# Altium schematic sheet prim_analog_in.SchDoc: foxBMS BMS-Slave 12-Cell
size A3; DocumentNumber: 9; SheetNumber: 9; SheetTotal: 19; AUTHOR: Fraunhofer IISB foxBMS Team; SheetDescription: Primary Analog Inputs
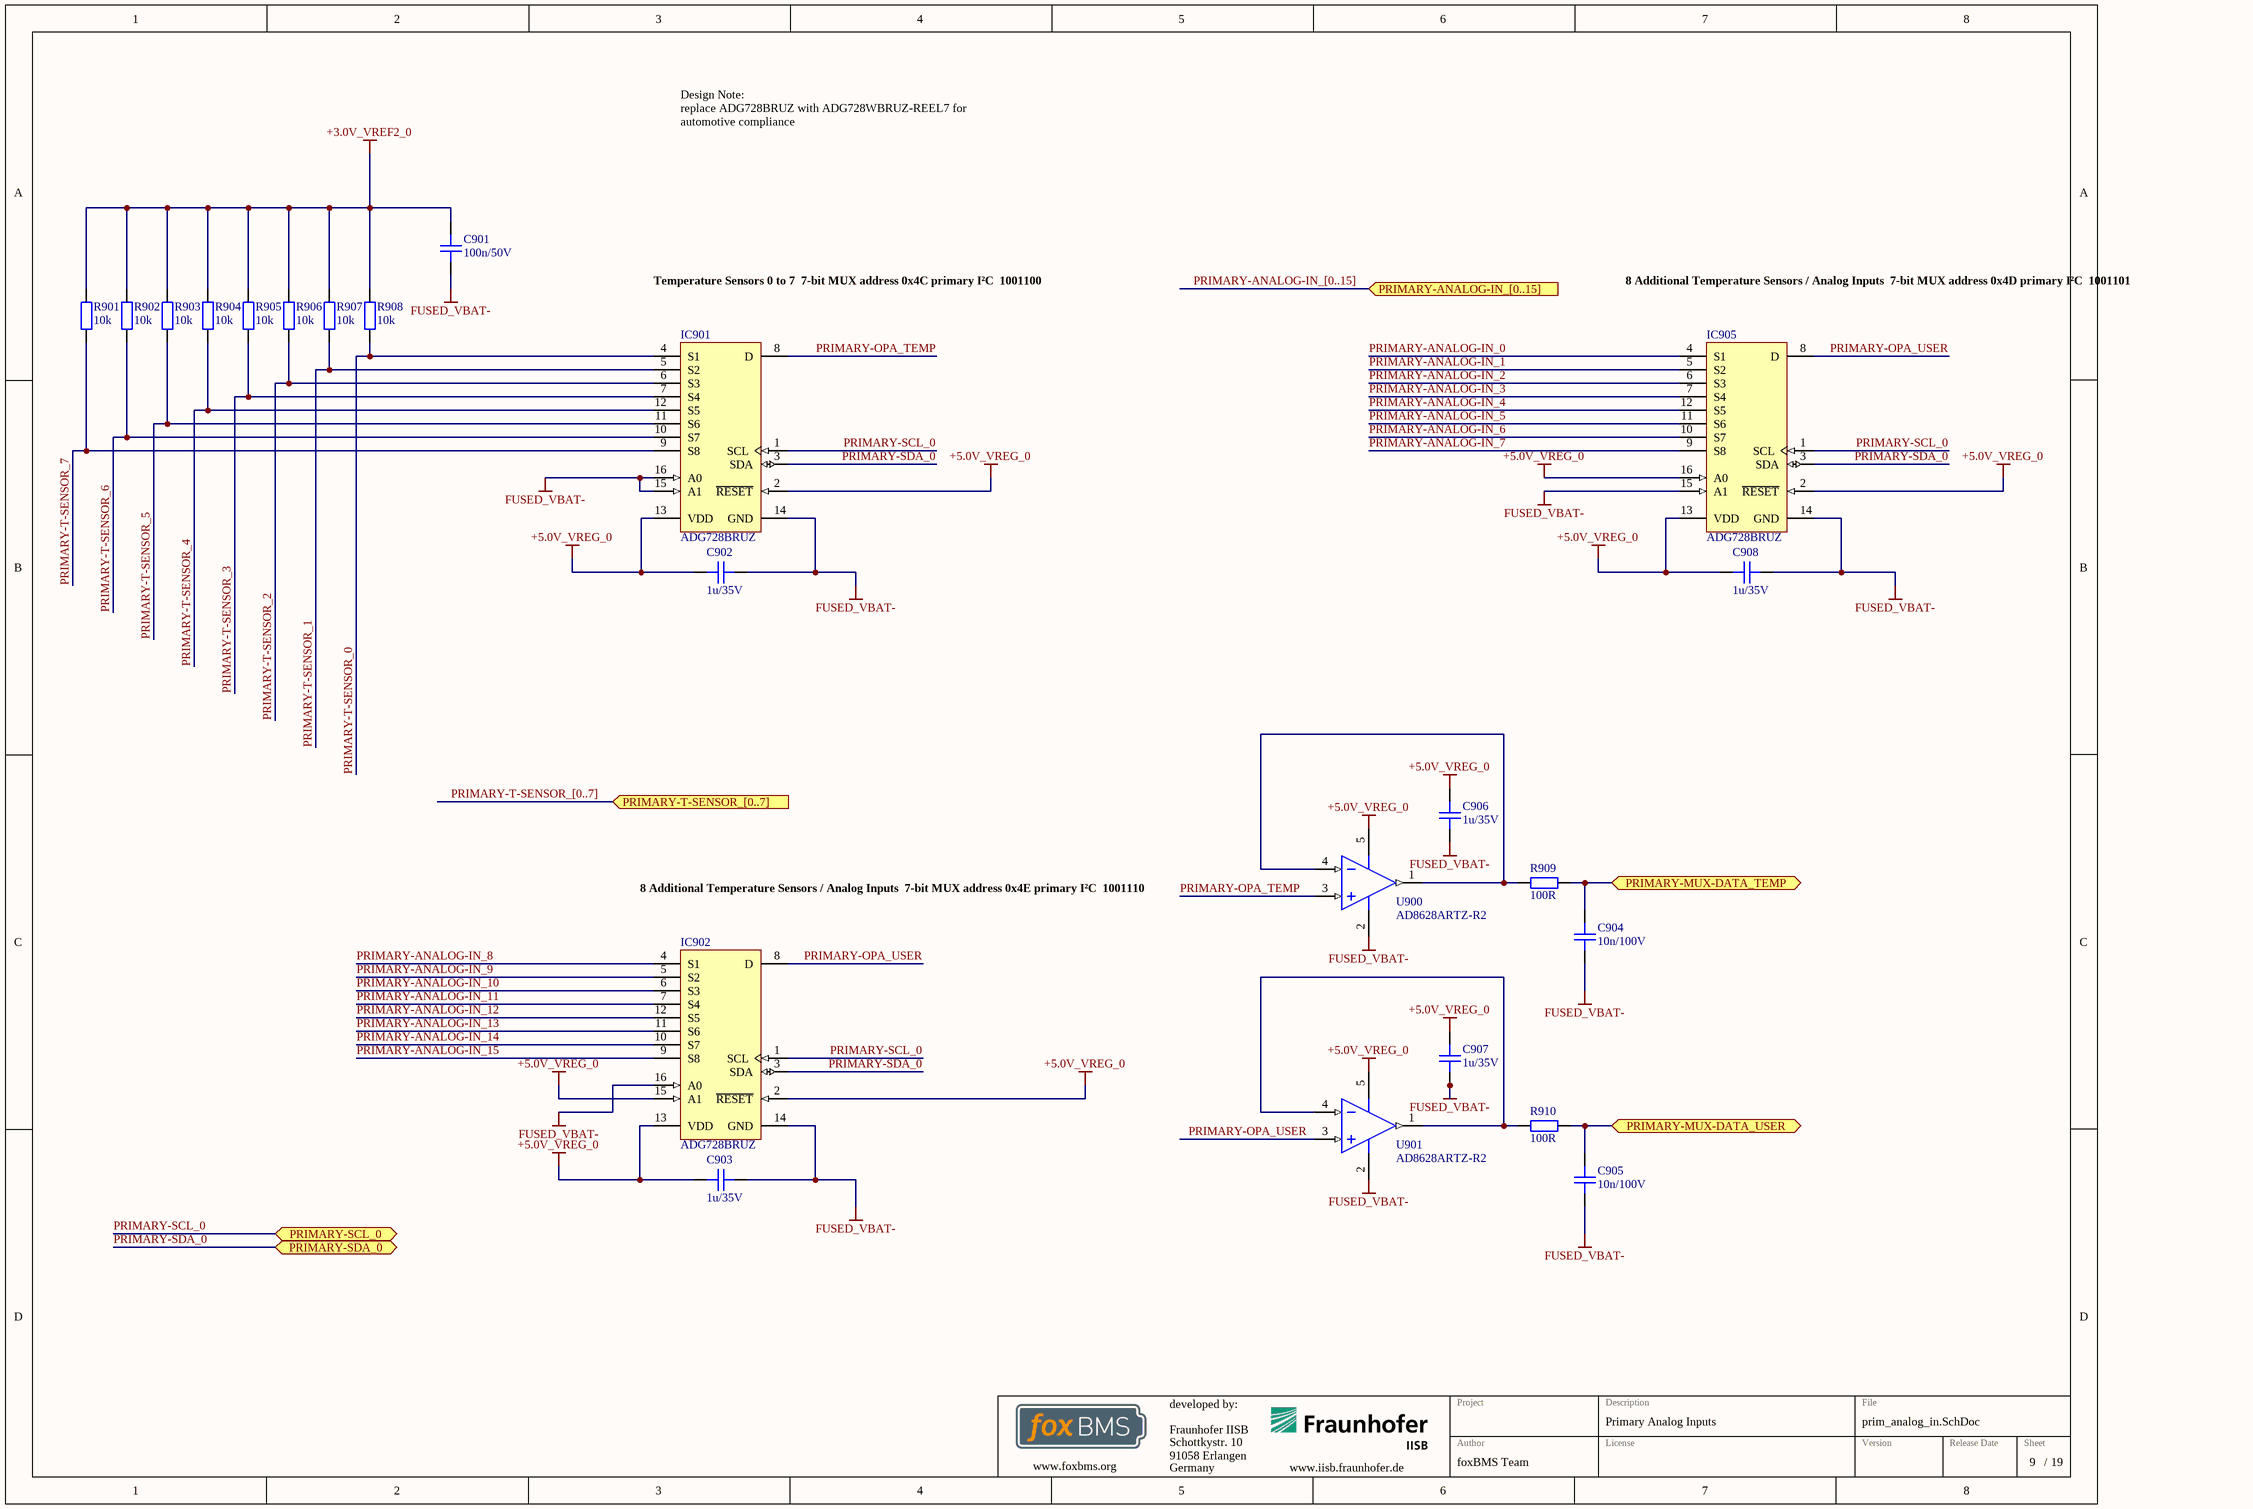
[diagram p0: prim_analog_in.SchDoc]

## Parts
C901  100n/50V  [CAPC1608X08N]
C902  1u/35V  [CAPC1608X08N]
C903  1u/35V  [CAPC1608X08N]
C904  10n/100V  [CAPC1608X08N]
C905  10n/100V  [CAPC1608X08N]
C906  1u/35V  [CAPC1608X08N]
C907  1u/35V  [CAPC1608X08N]
C908  1u/35V  [CAPC1608X08N]
IC901  ADG728BRUZ  [ADI-RU-16_M]
IC902  ADG728BRUZ  [ADI-RU-16_M]
IC905  ADG728BRUZ  [ADI-RU-16_M]
R901  10k  [RESC1608X05N]
R902  10k  [RESC1608X05N]
R903  10k  [RESC1608X05N]
R904  10k  [RESC1608X05N]
R905  10k  [RESC1608X05N]
R906  10k  [RESC1608X05N]
R907  10k  [RESC1608X05N]
R908  10k  [RESC1608X05N]
R909  100R  [RESC1608X05N]
R910  100R  [RESC1608X05N]
U900  AD8628ARTZ-R2  [ADI-RJ-5_M]
U901  AD8628ARTZ-R2  [ADI-RJ-5_M]

## Ports
PRIMARY-ANALOG-IN_[0..15] (in), PRIMARY-MUX-DATA_TEMP (bidir), PRIMARY-MUX-DATA_USER (bidir), PRIMARY-SCL_0 (bidir), PRIMARY-SDA_0 (bidir), PRIMARY-T-SENSOR_[0..7] (in)

## Nets
+3.0V_VREF2_0: C901.2 R901.2 R902.2 R903.2 R904.2 R905.2 R906.2 R907.2 R908.2
+5.0V_VREG_0: C902.2 C903.2 C906.2 C907.2 C908.2 IC901.2(~{RESET}) IC901.13(VDD) IC902.2(~{RESET}) IC902.13(VDD) IC902.15(A1) IC905.2(~{RESET}) IC905.13(VDD) IC905.16(A0) U900.5(+V) U901.5(+V)
FUSED_VBAT-: C901.1 C902.1 C903.1 C904.1 C905.1 C906.1 C907.1 C908.1 IC901.14(GND) IC901.15(A1) IC901.16(A0) IC902.14(GND) IC902.16(A0) IC905.14(GND) IC905.15(A1) U900.2(-V) U901.2(-V)
PRIMARY-ANALOG-IN_0: IC905.4(S1)
PRIMARY-ANALOG-IN_1: IC905.5(S2)
PRIMARY-ANALOG-IN_2: IC905.6(S3)
PRIMARY-ANALOG-IN_3: IC905.7(S4)
PRIMARY-ANALOG-IN_4: IC905.12(S5)
PRIMARY-ANALOG-IN_5: IC905.11(S6)
PRIMARY-ANALOG-IN_6: IC905.10(S7)
PRIMARY-ANALOG-IN_7: IC905.9(S8)
PRIMARY-ANALOG-IN_8: IC902.4(S1)
PRIMARY-ANALOG-IN_9: IC902.5(S2)
PRIMARY-ANALOG-IN_10: IC902.6(S3)
PRIMARY-ANALOG-IN_11: IC902.7(S4)
PRIMARY-ANALOG-IN_12: IC902.12(S5)
PRIMARY-ANALOG-IN_13: IC902.11(S6)
PRIMARY-ANALOG-IN_14: IC902.10(S7)
PRIMARY-ANALOG-IN_15: IC902.9(S8)
PRIMARY-MUX-DATA_TEMP: C904.2 R909.2 ; port PRIMARY-MUX-DATA_TEMP
PRIMARY-MUX-DATA_USER: C905.2 R910.2 ; port PRIMARY-MUX-DATA_USER
PRIMARY-OPA_TEMP: IC901.8(D) U900.3(+IN)
PRIMARY-OPA_USER: IC902.8(D) IC905.8(D) U901.3(+IN)
PRIMARY-SCL_0: IC901.1(SCL) IC902.1(SCL) IC905.1(SCL) ; port PRIMARY-SCL_0
PRIMARY-SDA_0: IC901.3(SDA) IC902.3(SDA) IC905.3(SDA) ; port PRIMARY-SDA_0
PRIMARY-T-SENSOR_0: IC901.4(S1) R908.1
PRIMARY-T-SENSOR_1: IC901.5(S2) R907.1
PRIMARY-T-SENSOR_2: IC901.6(S3) R906.1
PRIMARY-T-SENSOR_3: IC901.7(S4) R905.1
PRIMARY-T-SENSOR_4: IC901.12(S5) R904.1
PRIMARY-T-SENSOR_5: IC901.11(S6) R903.1
PRIMARY-T-SENSOR_6: IC901.10(S7) R902.1
PRIMARY-T-SENSOR_7: IC901.9(S8) R901.1
NetR909_1: R909.1 U900.1(OUT) U900.4(-IN)
NetR910_1: R910.1 U901.1(OUT) U901.4(-IN)

## Buses and harness runs
bus PRIMARY-ANALOG-IN_[0..15] = port PRIMARY-ANALOG-IN_[0..15]
bus PRIMARY-T-SENSOR_[0..7] = port PRIMARY-T-SENSOR_[0..7]

## Notes on the sheet
- Design Note:
  replace ADG728BRUZ with ADG728WBRUZ-REEL7 for automotive compliance
- Temperature Sensors 0 to 7
  7-bit MUX address 0x4C primary I²C
  1001100
- 8 Additional Temperature Sensors / Analog Inputs
  7-bit MUX address 0x4D primary I²C
  1001101
- 8 Additional Temperature Sensors / Analog Inputs
  7-bit MUX address 0x4E primary I²C
  1001110
- Fraunhofer IISB
- Schottkystr. 10
- developed by:
- 91058 Erlangen
- Germany
- Author
- Project
- License
- Description
- File
- Version
- Release Date
- Sheet
- www.foxbms.org
- www.iisb.fraunhofer.de
- foxBMS Team
- /

## Library data of the parts
C901 = gen_C_ceramic_100n_50V_X7R_0603: MLCC; Capacitance: 100n; Rated Voltage: 50V; Dielectric: X7R; Case EIA: 0603; Case Metric: 1608; PnP Package: C_0603_10; PnP Value: 100n/50V/X7R; PnP equipped: x; Automotive Qualified: False; Part Number: gen_C_ceramic_100n_50V_X7R_0603; Supplier 1: Farnell; Supplier Part Number 1: 2525267; Supplier 2: Digikey; Supplier Part Number 2: 490-6049-1-ND
C902 C903 C906-C908 = gen_C_ceramic_1u_35V_X7R_0603: MLCC; Capacitance: 1u; Rated Voltage: 35V; Dielectric: X7R; Case EIA: 0603; Case Metric: 1608; PnP Package: C_0603_10; PnP Value: 1uF/35V/X7R; PnP equipped: x; Automotive Qualified: False; Part Number: gen_C_ceramic_1u_35V_X7R_0603; Supplier 1: Farnell; Supplier Part Number 1: 1907508
C904 C905 = gen_C_ceramic_10n_100V_X7R_0603: MLCC; Capacitance: 10n; Rated Voltage: 100V; Dielectric: X7R; Case EIA: 0603; Case Metric: 1608; Automotive Qualified: False; Part Number: gen_C_ceramic_10n_100V_X7R_0603; Supplier 1: Farnell; Supplier Part Number 1: 1865545
IC901 IC902 IC905 = CMP-0798-00197-1: CMOS, Low Voltage, 2-Wire Serially Controlled, Matrix Switch, -40 to 85 degC, 16-pin SOP (RU-16), Tube; Manufacturer: Analog Devices; Ron (ohms): 2.5; Supply V Guar Performance: Single_(+3V), Single_(+5V); Max Analog Signal Range: 0 to Vdd; Bandwidth (Hz): 65M; ComponentLink3Description: Package Specification; Packing: Tube; PartNumber: ADG728BRUZ; ComponentLink1URL: http://www.analog.com/en/index.html; Mounting Technology: Surface Mount; DatasheetVersion: Rev. C; ComponentLink1Description: Manufacturer URL; ComponentLink3URL: http:/www.analog.com/static/imported-files/packages/36244347913743854010197452789RU16.pdf; ComponentLink2URL: http://www.analog.com/static/imported-files/data_sheets/ADG728_729.pdf; PackageVersion: Nov-02; PackageDescription: 16-Pin Thin Shrink Small Outline Package, Body 5 x 4.4 mm, Pitch 0.65 mm; Code_JEDEC: MO-153AB; PackageReference: RU-16; ComponentLink2Description: Datasheet
R901-R908 = gen_R_10k_0603: SMD Resistor 10k 0603; Tolerance: 1%; Power: 0.1W; Case EIA: 0603; Case Metric: 1608; Maximum Working Voltage: 75V; PnP Package: R_0603; Automotive Qualified: False; Part Number: gen_R_10k_0603; Operating Temperature: -55°C - +155°C; Resistance: 10k; Series: E24, E96; PnP Value: 10k; Supplier 1: Farnell; Supplier Part Number 1: 2073349
R909 R910 = gen_R_100R_0603: SMD Resistor 100R 0603; Tolerance: 1%; Power: 0.1W; Case EIA: 0603; Case Metric: 1608; Maximum Working Voltage: 75V; PnP Package: R_0603; Automotive Qualified: False; Part Number: gen_R_100R_0603; Operating Temperature: -55°C - +155°C; Resistance: 100R; Series: E24, E96; PnP Value: 100R; Supplier 1: Farnell; Supplier Part Number 1: 1469752
U900 U901 = CMP-0384-01512-2: Single Channel RRIO Operational Amplifier, 2.5 MHz BW, 1 V/us SR, Industrial, 5-pin SOT23 (RJ-5), Reel; Manufacturer: Analog Devices; Generic Part Number: AD8628; Iq/Amp: 1.1mA; Automotive Qualified: Yes; V Span Max: 6V; Input Bias Current: 30pA; Slew Rate: 1V/us; Amplifiers Per Package: 1; Input Offset Voltage: 1uV; Small Signal Bandwidth: 2.5MHz; V Span Min: 2.7V; ComponentLink1Description: Manufacturer URL; DatasheetVersion: Rev. I; ComponentLink4Description: Reference Circuit; Code_JEDEC: MO-178-AA; PackageDescription: 5-Pin Small Outline Transistor Package, Body 2.9 x 1.6 mm, Pitch 0.95 mm; ComponentLink3URL: http://www.analog.com/static/imported-files/packages/PKG_PDF/SOT-23(RJ)/RJ_5.pdf; PackageReference: RJ-5; ComponentLink1URL: http://www.analog.com/en/index.html; PackageVersion: 121608-A; RevisionNote: Reference Circuit URL fixed; Mounting Technology: Surface Mount; ComponentLink2Description: Datasheet; ComponentLink3Description: Package Specification; ComponentLink4URL: http://www.analog.com/en/all-operational-amplifiers-op-amps/operational-amplifiers-op-amps/ad8628/products/product.html#product-recommendations; ComponentLink2URL: http://www.analog.com/static/imported-files/data_sheets/AD8628_8629_8630.pdf; PartNumber: AD8628ARTZ-R2